# Altium schematic sheet Enc28j60.SchDoc
size A4
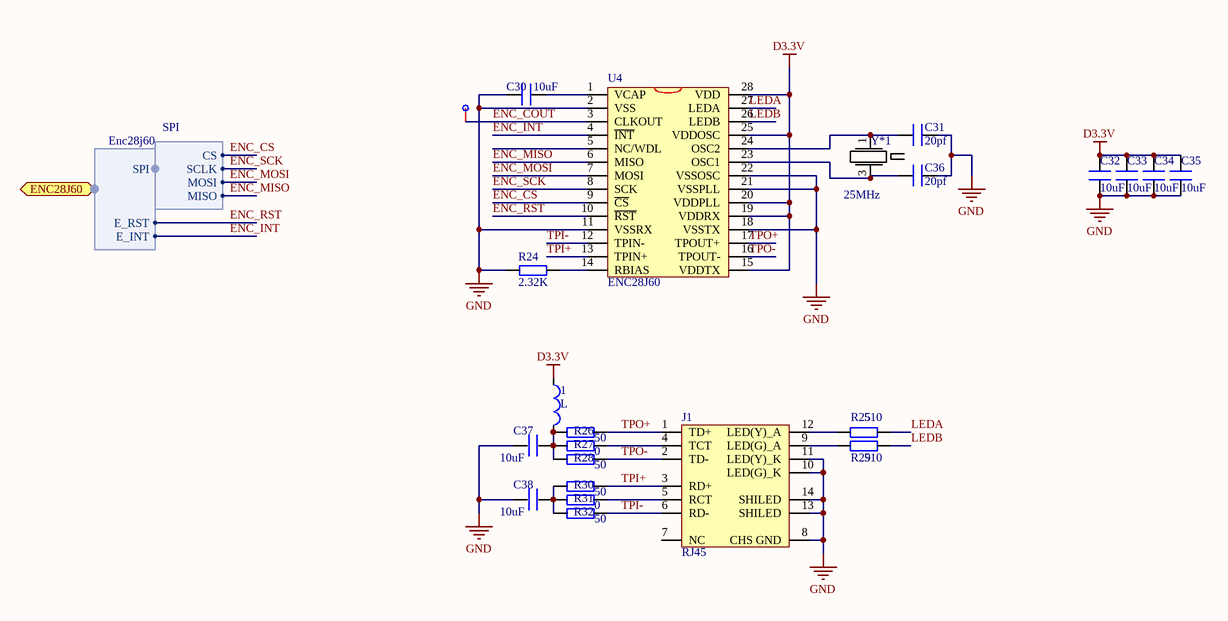
[diagram p0: Enc28j60.SchDoc]

## Parts
1  L  [0805]
*2  Point  [Point]  (value not drawn)
C30  10uF  [0805]
C31  20pf  [0603P]
C32  10uF  [0603P]
C33  10uF  [0603P]
C34  10uF  [0603P]
C35  10uF  [0603P]
C36  20pf  [0603P]
C37  10uF  [0603P]
C38  10uF  [0603P]
J1  RJ45  [HR911105A]
R24  2.32K  [0603P]
R25  510  [0603P]
R26  50  [0603P]
R27  0  [0603P]
R28  50  [0603P]
R29  510  [0603P]
R30  50  [0603P]
R31  0  [0603P]
R32  50  [0603P]
U4  ENC28J60  [SSOP28]
Y*1  25MHz  [4脚晶振]

## Ports
ENC28J60 (harness Enc28j60)

## Harnesses
Enc28j60: SPI, E_RST, E_INT
SPI: CS, SCLK, MOSI, MISO

## Nets
D3.3V: 1.2 C32.2 C33.2 C34.2 C35.2 U4.15(VDDTX) U4.19(VDDRX) U4.20(VDDPLL) U4.25(VDDOSC) U4.28(VDD)
GND: C30.1 C31.2 C32.1 C33.1 C34.1 C35.1 C36.2 C37.1 C38.1 J1.8(CHS_GND) J1.10(LED(G)_K) J1.11(LED(Y)_K) J1.13(SHILED) J1.14(SHILED) R24.1 U4.2(VSS) U4.11(VSSRX) U4.18(VSSTX) U4.21(VSSPLL) U4.22(VSSOSC)
ENC_COUT: *2.1(Point) U4.3(CLKOUT)
ENC_CS: U4.9(~{CS}) ; harness SPI.CS
ENC_INT: U4.4(~{INT}) ; port ENC28J60.E_INT
ENC_MISO: U4.6(MISO) ; harness SPI.MISO
ENC_MOSI: U4.7(MOSI) ; harness SPI.MOSI
ENC_RST: U4.10(~{RST}) ; port ENC28J60.E_RST
ENC_SCK: U4.8(SCK) ; harness SPI.SCLK
LEDA: R25.2 U4.27(LEDA)
LEDB: R29.2 U4.26(LEDB)
TPI+: J1.3(RD+) R30.2 U4.13(TPIN+)
TPI-: J1.6(RD-) R32.2 U4.12(TPIN-)
TPO+: J1.1(TD+) R26.2 U4.17(TPOUT+)
TPO-: J1.2(TD-) R28.2 U4.16(TPOUT-)
Net1_1: 1.1 C37.2 R26.1 R27.1 R28.1
NetC30_2: C30.2 U4.1(VCAP)
NetC31_1: C31.1 U4.24(OSC2) Y*1.1(O)
NetC36_1: C36.1 U4.23(OSC1) Y*1.3(O)
NetC38_2: C38.2 R30.1 R31.1 R32.1
NetJ1_4: J1.4(TCT) R27.2
NetJ1_5: J1.5(RCT) R31.2
NetJ1_9: J1.9(LED(G)_A) R29.1
NetJ1_12: J1.12(LED(Y)_A) R25.1
NetR24_2: R24.2 U4.14(RBIAS)

Not connected (* = marked no-connect by the designer): J1 7(NC); U4 5(NC/WDL); Y*1 2(G) 4(G)

## Library data of the parts
C30-C38 = C
J1 = HR911105
R24-R32 = R
Y*1 = XTAL_16M